# Altium project PCB_Project.PrjPcb
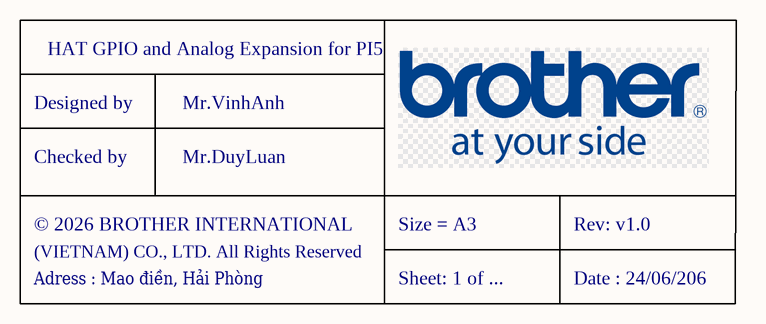
[diagram p0: Sheet1ofNumberHatExpansionAndAnalogForPi5.SchDoc]
2 sheets, 1 parts. Net scope: global (net labels, ports and power ports of the same name join across sheets).
Sheets:
  Sheet1ofNumberHatExpansionAndAnalogForPi5.SchDoc
  Sheet_HAT_GPIO_And_Analog_for_PI5.SchDoc

## Sheet Sheet1ofNumberHatExpansionAndAnalogForPi5.SchDoc
size A3; SheetNumber: 1; SheetTotal: 2

### Notes on the sheet
- HAT GPIO and Analog Expansion for PI5
- Designed by
- Mr.VinhAnh
- Checked by
- Mr.DuyLuan
- © 2026 BROTHER INTERNATIONAL
- (VIETNAM) CO., LTD. All Rights Reserved
- Adress : Mao điền, Hải Phòng
- Size = A3
- Sheet: 1 of ...
- Rev: v1.0
- Date : 24/06/206

## Sheet Sheet_HAT_GPIO_And_Analog_for_PI5.SchDoc
size A3; SheetNumber: 2; SheetTotal: 2
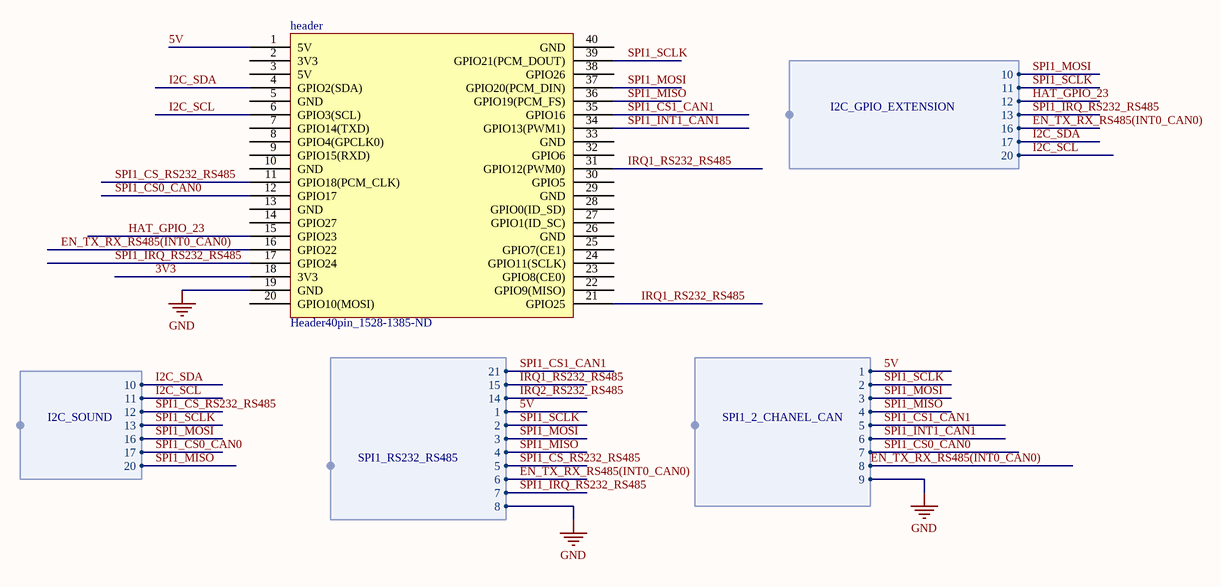
[diagram p1: Sheet_HAT_GPIO_And_Analog_for_PI5.SchDoc]

### Parts
header  Header40pin_1528-1385-ND  [RHDR40W60P254_2X20_5100X500X2300P]

### Harnesses
SPI1_RS232_RS485: 1, 2, 3, 4, 5, 6, 7, 8, 14, 15, 21
SPI1_2_CHANEL_CAN: 1, 2, 3, 4, 5, 6, 7, 8, 9
I2C_SOUND: 10, 11, 12, 13, 16, 17, 20
I2C_GPIO_EXTENSION: 10, 11, 12, 13, 16, 17, 20

### Nets
GND: header.19(GND) ; harness SPI1_RS232_RS485.8, harness SPI1_2_CHANEL_CAN.9
3V3: header.18(3V3)
5V: header.1(5V) ; harness SPI1_RS232_RS485.1, harness SPI1_2_CHANEL_CAN.1
EN_TX_RX_RS485(INT0_CAN0): header.16(GPIO22) ; harness SPI1_RS232_RS485.6, harness SPI1_2_CHANEL_CAN.8, harness I2C_GPIO_EXTENSION.16
HAT_GPIO_23: header.15(GPIO23) ; harness I2C_GPIO_EXTENSION.12
I2C_SCL: header.6(GPIO3(SCL)) ; harness I2C_SOUND.11, harness I2C_GPIO_EXTENSION.20
I2C_SDA: header.4(GPIO2(SDA)) ; harness I2C_SOUND.10, harness I2C_GPIO_EXTENSION.17
IRQ1_RS232_RS485: header.21(GPIO25) header.31(GPIO12(PWM0)) ; harness SPI1_RS232_RS485.15
IRQ2_RS232_RS485: harness SPI1_RS232_RS485.14
SPI1_CS0_CAN0: header.12(GPIO17) ; harness SPI1_2_CHANEL_CAN.7, harness I2C_SOUND.17
SPI1_CS1_CAN1: header.35(GPIO16) ; harness SPI1_RS232_RS485.21, harness SPI1_2_CHANEL_CAN.5
SPI1_CS_RS232_RS485: header.11(GPIO18(PCM_CLK)) ; harness SPI1_RS232_RS485.5, harness I2C_SOUND.12
SPI1_INT1_CAN1: header.34(GPIO13(PWM1)) ; harness SPI1_2_CHANEL_CAN.6
SPI1_IRQ_RS232_RS485: header.17(GPIO24) ; harness SPI1_RS232_RS485.7, harness I2C_GPIO_EXTENSION.13
SPI1_MISO: header.36(GPIO19(PCM_FS)) ; harness SPI1_RS232_RS485.4, harness SPI1_2_CHANEL_CAN.4, harness I2C_SOUND.20
SPI1_MOSI: header.37(GPIO20(PCM_DIN)) ; harness SPI1_RS232_RS485.3, harness SPI1_2_CHANEL_CAN.3, harness I2C_SOUND.16, harness I2C_GPIO_EXTENSION.10
SPI1_SCLK: header.39(GPIO21(PCM_DOUT)) ; harness SPI1_RS232_RS485.2, harness SPI1_2_CHANEL_CAN.2, harness I2C_SOUND.13, harness I2C_GPIO_EXTENSION.11

Not connected (* = marked no-connect by the designer): header 2(3V3) 3(5V) 5(GND) 7(GPIO14(TXD)) 8(GPIO4(GPCLK0)) 9(GPIO15(RXD)) 10(GND) 13(GND) 14(GPIO27) 20(GPIO10(MOSI)) 22(GPIO9(MISO)) 23(GPIO8(CE0)) 24(GPIO11(SCLK)) 25(GPIO7(CE1)) 26(GND) 27(GPIO1(ID_SC)) 28(GPIO0(ID_SD)) 29(GND) 30(GPIO5) 32(GPIO6) 33(GND) 38(GPIO26) 40(GND)

### Notes on the sheet
- HAT GPIO and Analog Expansion for PI5
- Designed by
- Mr.VinhAnh
- Checked by
- Mr.DuyLuan
- © 2026 BROTHER INTERNATIONAL
- (VIETNAM) CO., LTD. All Rights Reserved
- Adress : Mao điền, Hải Phòng
- Size = A3
- Sheet: 1 of ...
- Rev: v1.0
- Date : 24/06/206